# EAGLE design relais_node_01 (EAGLE 9.6.2)

## Sheet 1 of 2
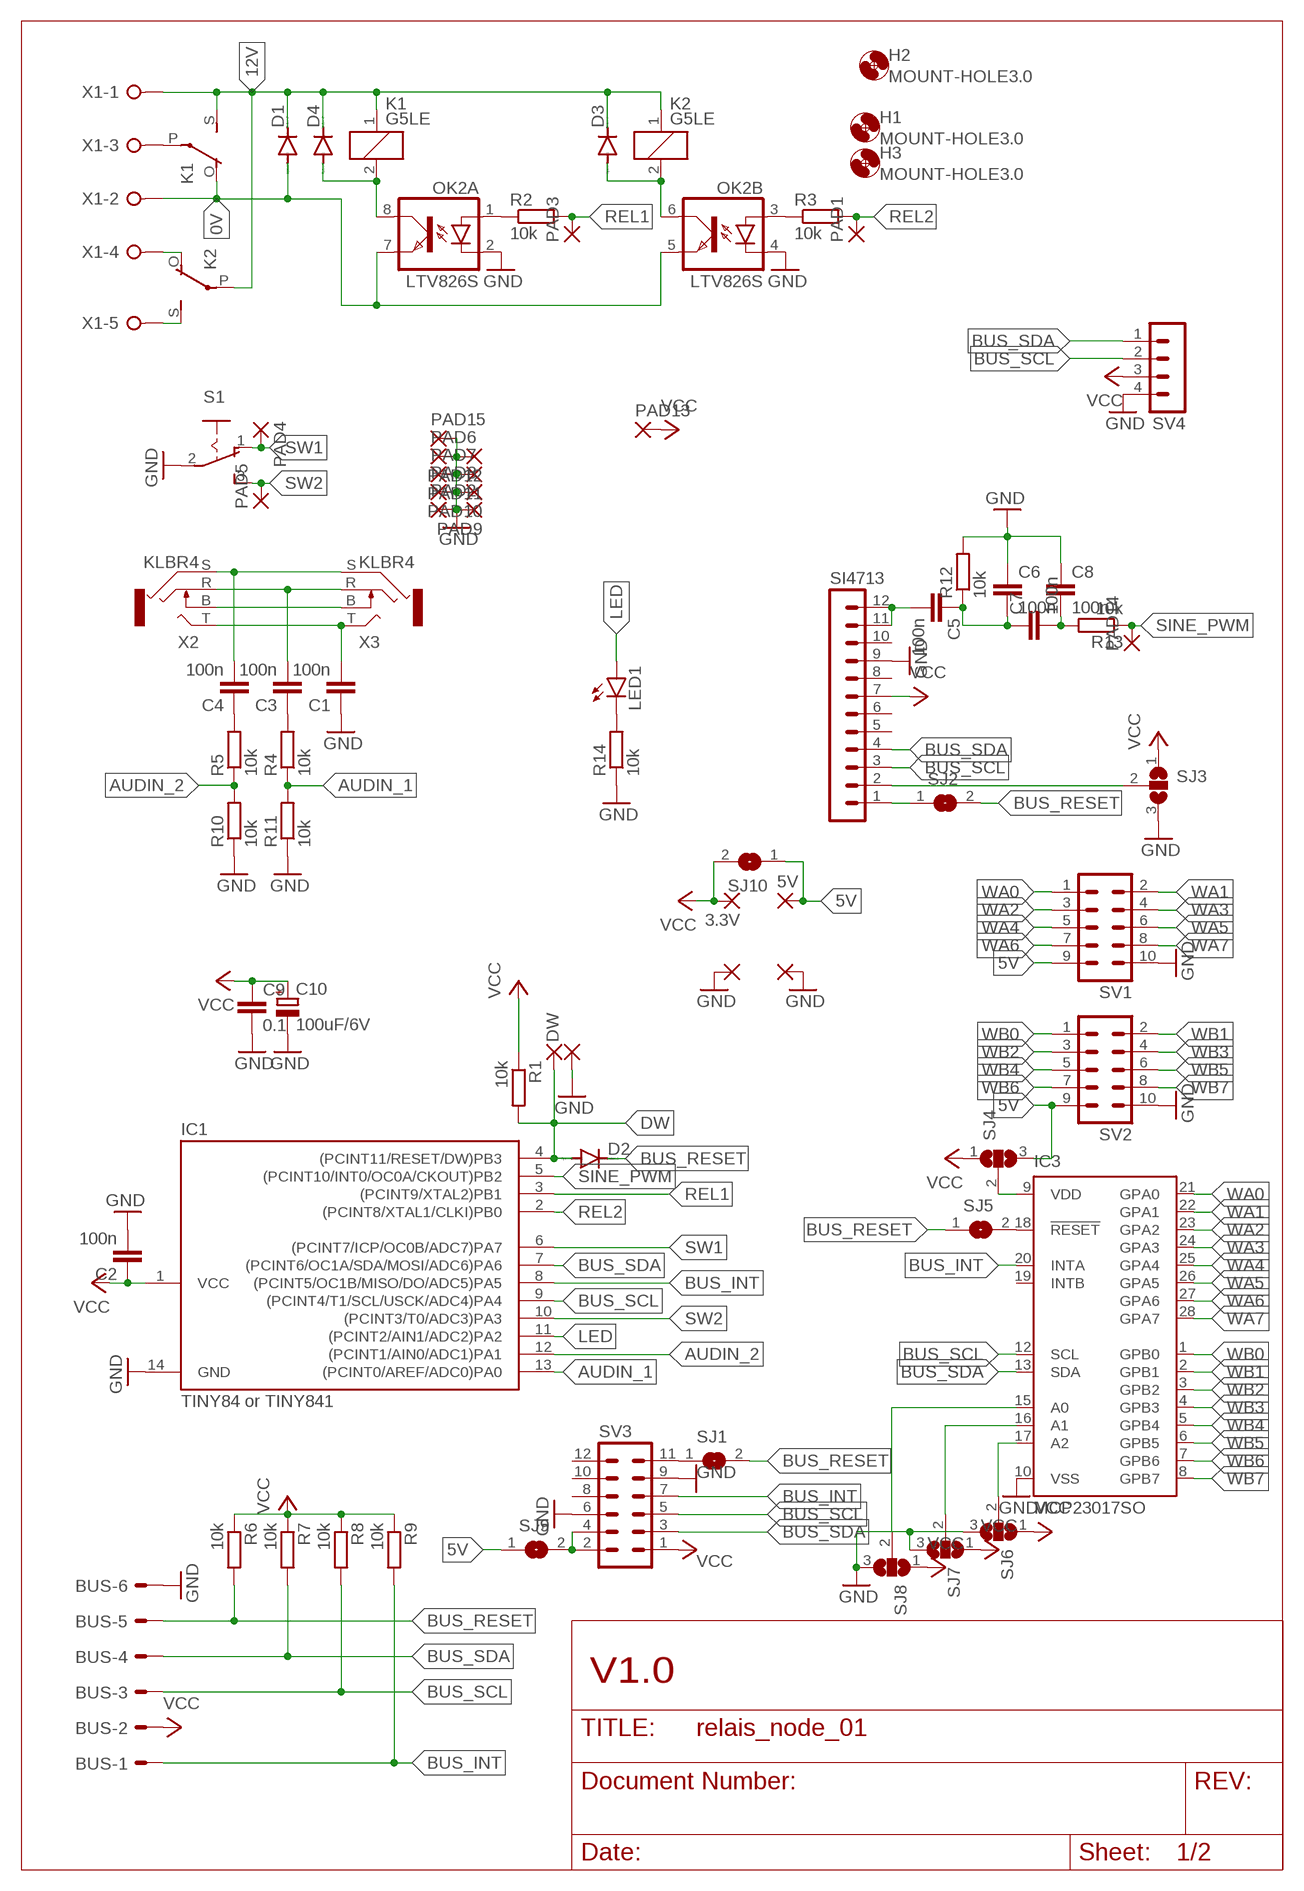
[diagram p0: schematic, sheet 1]

### Parts
3.3V  1,6/0,8  [1,6/0,8]
5V  1,6/0,8  [1,6/0,8]
BUS  ML6LE  [ML6L]
C1  100n  C-EUC0805  [C0805]
C2  100n  C-EUC0805  [C0805]
C3  100n  C-EUC0805  [C0805]
C4  100n  C-EUC0805  [C0805]
C5  100n  C-EUC0805  [C0805]
C6  100n  C-EUC0805  [C0805]
C7  100n  C-EUC0805  [C0805]
C8  100n  C-EUC0805  [C0805]
C9  0.1  C-EUC0805  [C0805]
C10  100uF/6V  CPOL-EUB/3528-21R  [B/3528-21R]
D1  DIODE-MELF-MLL41  [MELF-MLL41]
D2  DIODE-MINIMELF  [MINIMELF]
D3  DIODE-MINIMELF  [MINIMELF]
D4  DIODE-MINIMELF  [MINIMELF]
DW  1,6/0,9  [1,6/0,9]
GND_  1,6/0,9  [1,6/0,9]
H1  MOUNT-HOLE3.0  [3,0]
H2  MOUNT-HOLE3.0  [3,0]
H3  MOUNT-HOLE3.0  [3,0]
IC1  TINY84 or TINY841  TINY24/44/84-SSU  [SOIC14]
IC3  MCP23017SO  [SO28W]
K1  G5LE  [G5LE]
K2  G5LE  [G5LE]
LED1  LED3MM  [LED3MM]
OK2  LTV826S  [DIL8-SMD]
PAD1  1,6/0,8  [1,6/0,8]
PAD2  1,6/0,8  [1,6/0,8]
PAD3  1,6/0,8  [1,6/0,8]
PAD4  1,6/0,8  [1,6/0,8]
PAD5  1,6/0,8  [1,6/0,8]
PAD6  1,6/0,8  [1,6/0,8]
PAD7  1,6/0,8  [1,6/0,8]
PAD8  1,6/0,8  [1,6/0,8]
PAD9  1,6/0,8  [1,6/0,8]
PAD10  1,6/0,8  [1,6/0,8]
PAD11  1,6/0,8  [1,6/0,8]
PAD12  1,6/0,8  [1,6/0,8]
PAD13  1,6/0,8  [1,6/0,8]
PAD14  1,6/0,8  [1,6/0,8]
PAD15  1,6/0,8  [1,6/0,8]
PAD16  1,6/0,8  [1,6/0,8]
PAD17  1,6/0,8  [1,6/0,8]
R1  10k  R-EU_M0805  [M0805]
R2  10k  R-EU_M0805  [M0805]
R3  10k  R-EU_M0805  [M0805]
R4  10k  R-EU_M0805  [M0805]
R5  10k  R-EU_M0805  [M0805]
R6  10k  R-EU_M0805  [M0805]
R7  10k  R-EU_M0805  [M0805]
R8  10k  R-EU_M0805  [M0805]
R9  10k  R-EU_M0805  [M0805]
R10  10k  R-EU_M0805  [M0805]
R11  10k  R-EU_M0805  [M0805]
R12  10k  R-EU_M0805  [M0805]
R13  10k  R-EU_M0805  [M0805]
R14  10k  R-EU_M0805  [M0805]
S1  255SB  [255SB]
SI4713  MA12-1  [MA12-1]
SJ1  SJ  [SJ]
SJ2  SJ  [SJ]
SJ3  SJ2W  [SJ_2]
SJ4  SJ2W  [SJ_2]
SJ5  SJ  [SJ]
SJ6  SJ2W  [SJ_2]
SJ7  SJ2W  [SJ_2]
SJ8  SJ2W  [SJ_2]
SJ9  SJ  [SJ]
SJ10  SJ  [SJ]
SV1  ML10  [ML10]
SV2  ML10  [ML10]
SV3  MA06-2  [MA06-2]
SV4  MA04-1  [MA04-1]
X1  W237-05P  [W237-5P]
X2  KLBR4  [KLBR4]
X3  KLBR4  [KLBR4]

### Nets
0V [gnd]: D1.A K1.O(2:O) OK2.5(B:EMIT) OK2.7(A:EMIT) X1.2
5V [power]: 5V.1(P) SJ4.3 SJ9.1 SJ10.1 SV1.9 SV2.9
5VRPI [power]: SJ9.2 SV3.2 SV3.4
12V [power]: D1.C D3.C D4.C K1.1 K1.S(2:S) K2.1 K2.P(2:P) X1.1
AUDIN_1: IC1.13((PCINT0/AREF/ADC0)PA0) R4.1 R11.2
AUDIN_2: IC1.12((PCINT1/AIN0/ADC1)PA1) R5.1 R10.2
B [power]: X2.B X3.B
BUS_INT: BUS.1 IC1.8((PCINT5/OC1B/MISO/DO/ADC5)PA5) IC3.20(INTA) R9.2 SV3.7
BUS_RESET: BUS.5 D2.C R6.2 SJ1.2 SJ2.2 SJ5.1
BUS_SCL: BUS.3 IC1.9((PCINT4/T1/SCL/USCK/ADC4)PA4) IC3.12(SCL) R8.2 SI4713.3 SV3.5 SV4.2
BUS_SDA: BUS.4 IC1.7((PCINT6/OC1A/SDA/MOSI/ADC6)PA6) IC3.13(SDA) R7.2 SI4713.4 SV3.3 SV4.1
DW: D2.A DW.1(P) IC1.4((PCINT11/RESET/DW)PB3) R1.2
GND [gnd]: BUS.6 C1.1 C2.2 C6.1 C8.1 C9.2 C10.- GND_.1(P) IC1.14(GND) IC3.10(VSS) OK2.2(A:C) OK2.4(B:C) PAD2.1(P) PAD6.1(P) PAD7.1(P) PAD8.1(P) PAD9.1(P) PAD10.1(P) PAD11.1(P) PAD12.1(P) PAD15.1(P) PAD16.1(P) PAD17.1(P) R10.1 R11.1 R12.2 R14.1 S1.2(P) SI4713.9 SJ3.3 SJ6.3 SJ7.3 SJ8.3 SV1.10 SV2.10 SV3.6 SV3.9 SV4.4
LED: IC1.11((PCINT2/AIN1/ADC2)PA2) LED1.A
N$1: SJ1.1 SV3.11
N$2: K1.P(2:P) X1.3
N$3: D4.A K1.2 OK2.8(A:COL)
N$4: D3.A K2.2 OK2.6(B:COL)
N$5: K2.S(2:S) X1.5
N$6: K2.O(2:O) X1.4
N$7: OK2.1(A:A) R2.1
N$8: OK2.3(B:A) R3.1
N$13: C3.1 R4.2
N$14: C4.1 R5.2
N$15: SI4713.1 SJ2.1
N$16: SI4713.2 SJ3.2
N$17: LED1.K(C) R14.2
N$18: IC3.9(VDD) SJ4.2
N$19: IC3.18(!RESET) SJ5.2
N$21: C5.2 SI4713.11 SI4713.12
N$22: C5.1 C6.2 C7.1 R12.1
N$23: C7.2 C8.2 R13.2
N$27: IC3.17(A2) SJ6.2
N$28: IC3.16(A1) SJ7.2
N$29: IC3.15(A0) SJ8.2
R [power]: C3.2 X2.R X3.R
REL1: IC1.3((PCINT9/XTAL2)PB1) PAD3.1(P) R2.2
REL2: IC1.2((PCINT8/XTAL1/CLKI)PB0) PAD1.1(P) R3.2
S [power]: C4.2 X2.S X3.S
SINE_PWM: IC1.5((PCINT10/INT0/OC0A/CKOUT)PB2) PAD14.1(P) R13.1
SW1: IC1.6((PCINT7/ICP/OC0B/ADC7)PA7) PAD4.1(P) S1.1(O)
SW2: IC1.10((PCINT3/T0/ADC3)PA3) PAD5.1(P) S1.3(S)
T [power]: C1.2 X2.T X3.T
VCC [power]: 3.3V.1(P) BUS.2 C2.1 C9.1 C10.+ IC1.1(VCC) PAD13.1(P) R1.1 R6.1 R7.1 R8.1 R9.1 SI4713.7 SJ3.1 SJ4.1 SJ6.1 SJ7.1 SJ8.1 SJ10.2 SV3.1 SV4.3
WA0: IC3.21(GPA0) SV1.1
WA1: IC3.22(GPA1) SV1.2
WA2: IC3.23(GPA2) SV1.3
WA3: IC3.24(GPA3) SV1.4
WA4: IC3.25(GPA4) SV1.5
WA5: IC3.26(GPA5) SV1.6
WA6: IC3.27(GPA6) SV1.7
WA7: IC3.28(GPA7) SV1.8
WB0: IC3.1(GPB0) SV2.1
WB1: IC3.2(GPB1) SV2.2
WB2: IC3.3(GPB2) SV2.3
WB3: IC3.4(GPB3) SV2.4
WB4: IC3.5(GPB4) SV2.5
WB5: IC3.6(GPB5) SV2.6
WB6: IC3.7(GPB6) SV2.7
WB7: IC3.8(GPB7) SV2.8
Unconnected: IC3.19(INTB) SI4713.5 SI4713.6 SI4713.8 SI4713.10 SV3.8 SV3.10 SV3.12

### Notes on the sheet
- V1.0

## Sheet 2 of 2

## Library data of the parts
3.3V 5V PAD1-PAD17 = wirepad:1,6/0,8: THROUGH-HOLE PAD
BUS = con-harting-ml:ML6?E: HARTING; OC_FARNELL: unknown; OC_NEWARK: unknown
C1-C9 = rcl:C-EU: CAPACITOR, European symbol
C10 = rcl:CPOL-EU: POLARIZED CAPACITOR, European symbol
D1-D4 = diode:DIODE-: DIODE
DW GND_ = wirepad:1,6/0,9: THROUGH-HOLE PAD
H1-H3 = holes:MOUNT-HOLE: MOUNTING HOLE with drill center marker
IC1 = avr-7:TINY24/44/84
IC3 = microchip-6:MCP23017: http://ww1.microchip.com/downloads/en/DeviceDoc/21952a.pdf Source: http://ww1.microchip.com/downloads/en/DeviceDoc/21952a.pdf
K1 K2 = relay:G5LE: RELAY 1 x switch, 10 A/120 V AC, 8 A/30 V DC, Omron; OC_FARNELL: unknown; OC_NEWARK: unknown
LED1 = led:LED: LED OSRAM: - CHIPLED LG R971, LG N971, LY N971, LG Q971, LY Q971, LO R971, LY R971 LH N974, LH R974 LS Q976, LO Q976, LY Q976 LO Q996 - Hyper CHIPLED LW Q18S LB Q993, LB Q99A, LB R99A - SideLED LS A670, LO A670, LY A670, LG A670, LP A670 LB A673, LV A673, LT A673, LW A673 LH A674 LY A675 LS A676, LA A676, LO A676, LY A676, LW A676 LS A679, LY A679, LG A679 - Hyper Micro SIDELED® LS Y876, LA Y876, LO Y876, LY Y876 LT Y87S - SmartLED LW L88C, LW L88S LB L89C, LB L89S, LG L890 LS L89K, LO L89K, LY L89K LS L896, LA L896, LO L896, LY L896 - TOPLED LS T670, LO T670, LY T670, LG T670, LP T670 LSG T670, LSP T670, LSY T670, LOP T670, LYG T670 LG T671, LOG T671, LSG T671 LB T673, LV T673, LT T673, LW T673 LH T674 LS T676, LA T676, LO T676, LY T676, LB T676, LH T676, LSB T676, LW T676 LB T67C, LV T67C, LT T67C, LS T67K, LO T67K, LY T67K, LW E67C LS E67B, LA E67B, LO E67B, LY E67B, LB E67C, LV E67C, LT E67C LW T67C LS T679, LY T679, LG T679 LS T770, LO T770, LY T770, LG T770, LP T770 LB T773, LV T773, LT T773, LW T773 LH T774 LS E675, LA E675, LY E675, LS T675 LS T776, LA T776, LO T776, LY T776, LB T776 LHGB T686 LT T68C, LB T68C - Hyper Mini TOPLED® LB M676 - Mini TOPLED Santana® LG M470 LS M47K, LO M47K, LY M47K Source: http://www.osram.convergy.de LUXEON: - LUMILED® LXK2-PW12-R00, LXK2-PW12-S00, LXK2-PW14-U00, LXK2-PW14-V00 LXK2-PM12-R00, LXK2-PM12-S00, LXK2-PM14-U00 LXK2-PE12-Q00, LXK2-PE12-R00, LXK2-PE12-S00, LXK2-PE14-T00, LXK2-PE14-U00 LXK2-PB12-K00, LXK2-PB12-L00, LXK2-PB12-M00, LXK2-PB14-N00, LXK2-PB14-P00, LXK2-PB14-Q00 LXK2-PR12-L00, LXK2-PR12-M00, LXK2-PR14-Q00, LXK2-PR14-R00 LXK2-PD12-Q00, LXK2-PD12-R00, LXK2-PD12-S00 LXK2-PH12-R00, LXK2-PH12-S00 LXK2-PL12-P00, LXK2-PL12-Q00, LXK2-PL12-R00 Source: www.luxeon.com KINGBRIGHT: KA-3528ASYC Source: www.kingbright.com
OK2 = optocoupler:LTV826: OPTO COUPLER Source: LITEON, LTV816.pdf; OC_FARNELL: unknown; OC_NEWARK: unknown
R1-R14 = rcl:R-EU_: RESISTOR, European symbol; SPICEPREFIX: R
S1 = switch:255SB: SLIDING SWITCH Distributor Buerklin, 11G810
SI4713 = con-lstb:MA12-1: PIN HEADER; OC_FARNELL: unknown; OC_NEWARK: unknown
SJ1 SJ2 SJ5 SJ9 SJ10 = jumper:SJ: SMD solder JUMPER
SJ3 SJ4 SJ6-SJ8 = jumper:SJ2W: SMD solder JUMPER
SV1 SV2 = con-harting-ml:ML10: HARTING; OC_FARNELL: unknown; OC_NEWARK: unknown
SV3 = con-lstb:MA06-2: PIN HEADER; OC_FARNELL: unknown; OC_NEWARK: unknown
SV4 = con-lstb:MA04-1: PIN HEADER; OC_FARNELL: unknown; OC_NEWARK: unknown
X1 = con-wago-508:W237-05P: WAGO SREW CLAMP; OC_FARNELL: unknown; OC_NEWARK: unknown
X2 X3 = con-lumberg:KLBR4: Jack connectors according to JISC 6560, 3.5 mm Klinkeneinbaukupplung nach JISC 6560, 3,5 mm, 3-polig/ stereo, abgewinkelte Ausführung, mit Öffner, für Leiterplatten Source: Data sheet <http://www.lumberg.com/Produkte/PDFs/KLBR4.pdf>; MPN: KLBR 4; OC_FARNELL: 1217016; OC_NEWARK: 97K2709

## Net classes
1 gnd: width 0.381 mm, drill 0.381 mm
2 power: width 0.381 mm, drill 0.381 mm

## Board
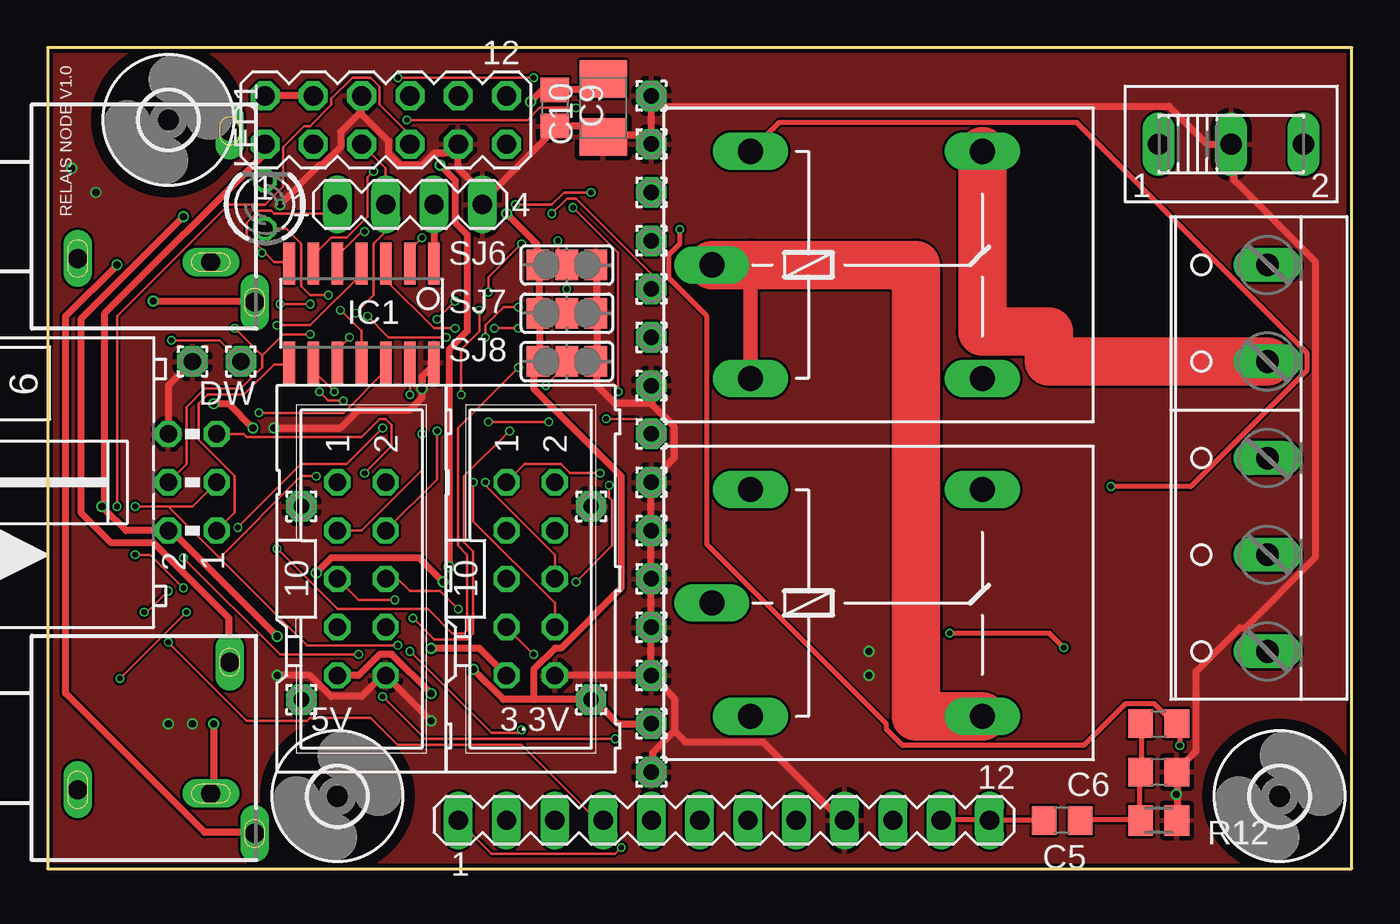
[diagram p1: board, top side]
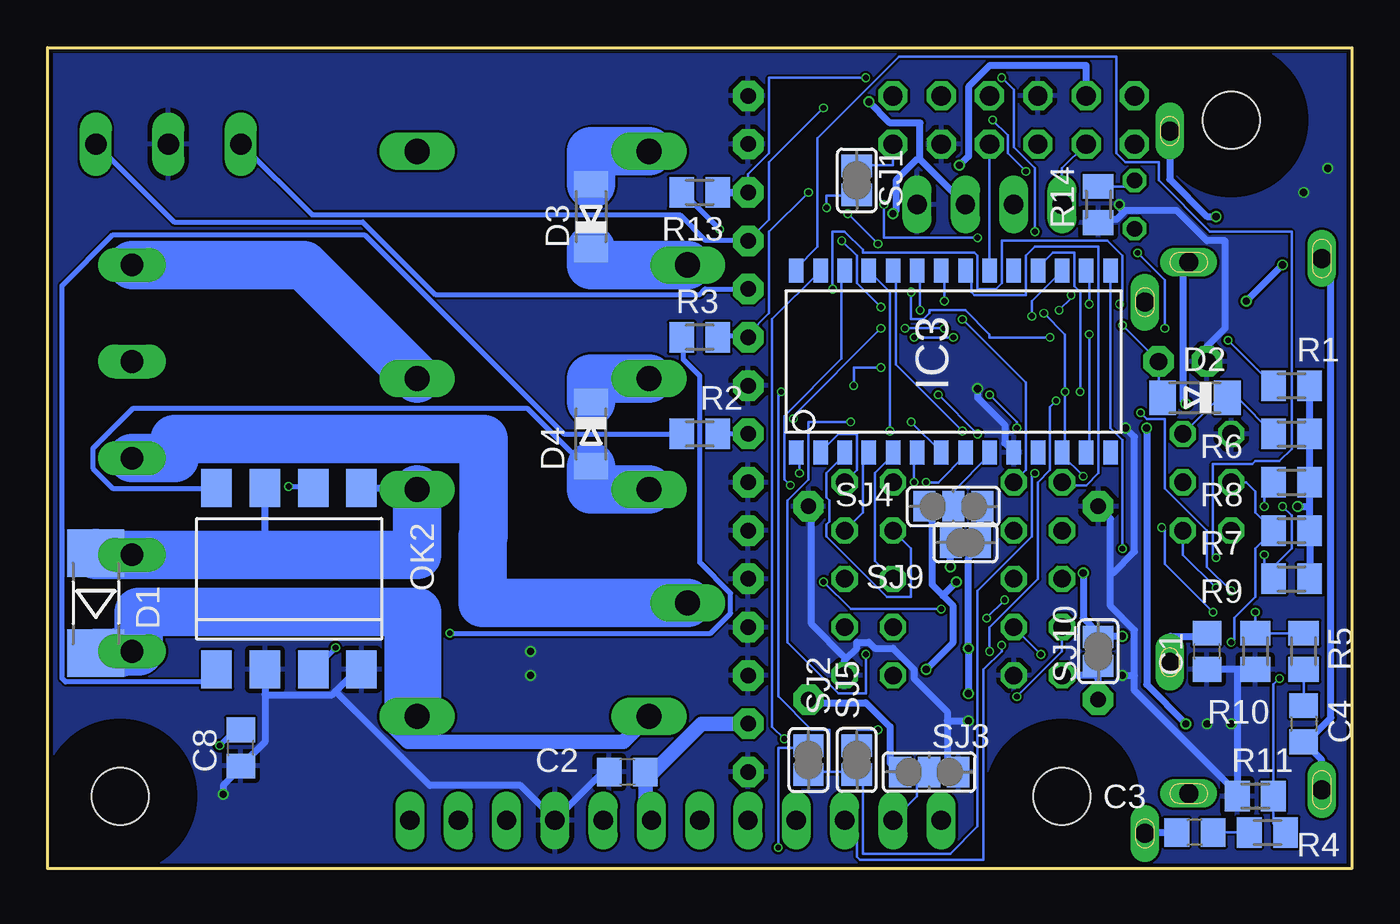
[diagram p2: board, bottom side, seen from below]

Size 68.58 x 43.18 mm. Coordinates in mm from the lower left corner, seen from the top.
Outline: 0,0 68.58,0 68.58,43.18 0,43.18 0,0
Copper layers (1*16): Top 0.035559375mm / dielectric 1.6mm / Bottom 0.035559375mm
Design rules "jlcpcb2layer": minimum track width 5mil, minimum drill 12mil, track to track 5mil, track to pad 5mil, pad to pad 5mil, via to via 5mil, smd to smd 5mil, copper to edge 8mil, drill to drill 6mil, minimum pad ring 5mil, minimum via ring 3mil, stop-mask expansion 2.5mil, vias tented up to drill 0mil, thermal gap 10mil

### Footprints (pad centres in the part's own frame; a part is rotated, then mirrored left to right if it is on the bottom)
1,6/0,8 = drill 0.813 pad 1.6 octagon: 1 0,0
ML6L = drill 0.914 octagon: 1 -2.54,-1.27; 2 -2.54,1.27; 3 0,-1.27; 4 0,1.27; 5 2.54,-1.27; 6 2.54,1.27
C0805 = smd 1.3 x 1.5: 1 -0.95,0; 2 0.95,0
B/3528-21R = smd 1.95 x 2.5: + 1.525,0; - -1.525,0
MELF-MLL41 = smd 2.5 x 3: A 2.625,0; C -2.625,0
MINIMELF = smd 1.4 x 1.8: A 1.7,0; C -1.7,0
1,6/0,9 = drill 0.914 pad 1.6 octagon: 1 0,0
3,0 = hole 3: 0,0
SOIC14 = smd 0.61 x 2.21: 1 -3.81,-2.603; 2 -2.54,-2.603; 3 -1.27,-2.603; 4 0,-2.603; 5 1.27,-2.603; 6 2.54,-2.603; 7 3.81,-2.603; 8 3.81,2.603; 9 2.54,2.603; 10 1.27,2.603; 11 0,2.603; 12 -1.27,2.603; 13 -2.54,2.603; 14 -3.81,2.603
SO28W = smd 0.762 x 1.27: 1 -7.62,-4.78; 2 -6.35,-4.78; 3 -5.08,-4.78; 4 -3.81,-4.78; 5 -2.54,-4.78; 6 -1.27,-4.78; 7 0,-4.78; 8 1.27,-4.78; 9 2.54,-4.78; 10 3.81,-4.78; 11 5.08,-4.78; 12 6.35,-4.78; 13 7.62,-4.78; 14 8.89,-4.78; 15 8.89,4.78; 16 7.62,4.78; 17 6.35,4.78; 18 5.08,4.78; 19 3.81,4.78; 20 2.54,4.78; 21 1.27,4.78; 22 0,4.78; 23 -1.27,4.78; 24 -2.54,4.78; 25 -3.81,4.78; 26 -5.08,4.78; 27 -6.35,4.78; 28 -7.62,4.78
G5LE = drill 1.321 long: 1 -7.493,-5.969; 2 -7.493,5.969; O 4.699,5.969; P -9.525,0; S 4.699,-5.969
LED3MM = drill 0.813 octagon: A -1.27,0; K 1.27,0
DIL8-SMD = smd 1.6 x 2: 1 -3.81,-4.77; 2 -1.27,-4.77; 3 1.27,-4.77; 4 3.81,-4.77; 5 3.81,4.77; 6 1.27,4.77; 7 -1.27,4.77; 8 -3.81,4.77
M0805 = smd 1.3 x 1.6: 1 -0.95,0; 2 0.95,0
255SB = drill 1.118 long: 1 -3.81,0; 2 0,0; 3 3.81,0
MA12-1 = drill 1.016 long: 1 -13.97,0; 2 -11.43,0; 3 -8.89,0; 4 -6.35,0; 5 -3.81,0; 6 -1.27,0; 7 1.27,0; 8 3.81,0; 9 6.35,0; 10 8.89,0; 11 11.43,0; 12 13.97,0
SJ = smd 1.168 x 1.6: 1 -0.762,0; 2 0.762,0
SJ_2 = smd 1.168 x 1.6: 1 -1.524,0; 2 0,0; 3 1.524,0
ML10 = drill 0.914 octagon: 1 -5.08,-1.27; 2 -5.08,1.27; 3 -2.54,-1.27; 4 -2.54,1.27; 5 0,-1.27; 6 0,1.27; 7 2.54,-1.27; 8 2.54,1.27; 9 5.08,-1.27; 10 5.08,1.27
MA06-2 = drill 1.016 octagon: 1 -6.35,-1.27; 2 -6.35,1.27; 3 -3.81,-1.27; 4 -3.81,1.27; 5 -1.27,-1.27; 6 -1.27,1.27; 7 1.27,-1.27; 8 1.27,1.27; 9 3.81,-1.27; 10 3.81,1.27; 11 6.35,-1.27; 12 6.35,1.27
MA04-1 = drill 1.016 long: 1 -3.81,0; 2 -1.27,0; 3 1.27,0; 4 3.81,0
W237-5P = drill 1.194 long: 1 -10.16,-0.635; 2 -5.08,-0.635; 3 0,-0.635; 4 5.08,-0.635; 5 10.16,-0.635
KLBR4 = drill 1 pad 1.3 long: B -2.4,-3.5; S -2.2,3.5 | drill 1 pad 1.2 long: R -4.5,-5.8; T 4.5,-4.5

### Placement (x,y rotation side)
3.3V  28.57,8.89 90 top
5V  13.34,8.89 90 top
BUS  7.62,20.32 90 top
C1  7.62,11.43 90 bottom
C2  38.1,5.08 180 bottom
C3  8.26,1.91 180 bottom
C4  2.54,7.62 270 bottom
C5  53.34,2.54 180 top
C6  58.42,5.08 180 top
C7  58.42,7.62 0 top
C8  58.42,6.35 90 bottom
C9  26.67,40.01 270 top
C10  29.21,40.01 90 top
D1  66.04,13.97 90 bottom
D2  8.26,24.77 180 bottom
D3  40.01,34.29 90 bottom
D4  40.01,22.86 270 bottom
DW  10.16,26.67 90 top
GND_  7.62,26.67 90 top
H1  64.77,3.81 0 top
H2  6.35,39.37 0 top
H3  15.24,3.81 0 top
IC1  16.51,29.21 180 top
IC3  21.59,26.67 0 bottom
K1  44.45,13.97 0 top
K2  44.45,31.75 0 top
LED1  11.43,34.92 90 top
OK2  55.88,15.24 0 bottom
PAD1  31.75,27.94 0 top
PAD2  31.75,5.08 0 top
PAD3  31.75,22.86 0 top
PAD4  31.75,33.02 0 top
PAD5  31.75,30.48 0 top
PAD6  31.75,38.1 0 top
PAD7  31.75,25.4 0 top
PAD8  31.75,20.32 0 top
PAD9  31.75,17.78 0 top
PAD10  31.75,15.24 0 top
PAD11  31.75,12.7 0 top
PAD12  31.75,10.16 0 top
PAD13  31.75,7.62 0 top
PAD14  31.75,35.56 0 top
PAD15  31.75,40.64 0 top
PAD16  13.34,19.05 90 top
PAD17  28.57,19.05 90 top
R1  3.17,25.4 180 bottom
R2  34.29,22.86 0 bottom
R3  34.29,27.94 0 bottom
R4  4.45,1.91 180 bottom
R5  2.54,11.43 270 bottom
R6  3.17,22.86 180 bottom
R7  3.17,17.78 180 bottom
R8  3.17,20.32 180 bottom
R9  3.17,15.24 180 bottom
R10  5.08,11.43 90 bottom
R11  5.08,3.81 0 bottom
R12  58.42,2.54 0 top
R13  34.29,35.56 180 bottom
R14  13.34,34.92 90 bottom
S1  62.23,38.1 0 top
SI4713  35.56,2.54 0 top
SJ1  26.04,36.2 270 bottom
SJ2  28.57,5.71 270 bottom
SJ3  22.23,5.08 0 bottom
SJ4  20.95,19.05 0 bottom
SJ5  26.04,5.71 90 bottom
SJ6  27.3,31.75 0 top
SJ7  27.3,29.21 0 top
SJ8  27.3,26.67 0 top
SJ9  20.32,17.14 180 bottom
SJ10  13.34,11.43 90 bottom
SV1  16.51,15.24 270 top
SV2  25.4,15.24 270 top
SV3  17.78,39.37 0 top
SV4  19.05,34.92 0 top
X1  63.5,21.59 90 top
X2  5.08,34.29 90 top
X3  5.08,6.35 90 top

### Tracks (layer width: path | path; a pad name or v marks a point on that pad's centre or on a via)
0V
  Bottom 0.381: OK2.5 52.01,20 50.39,20 K1.O | 57.15,16.51 OK2.7
  Bottom 2.54: K1.O 49.15,16.51 57.15,16.51 X1.2 66.04,16.51 D1.A
5V  (via drill 0.38)
  Top 0.381: v20.16,11.59 22.7,11.59 SV2.9 | SV1.9 16.35,10.16 17.46,11.27 18.1,11.27 v20.16,9.21
  Bottom 0.381: 5V.1 SJ10.1 13.49,10.16 SV1.9 | SJ4.3 19.53,19.05 19.53,17.14 SJ9.1 19.53,16.99 20.16,16.35 v20.16,11.59 v20.16,9.21
5VRPI  (via drill 0.38)
  Top 0.381: v21.11,15.88 21.11,27.3 22.07,28.26 22.07,33.34 21.43,33.97 21.43,36.2 v20.64,36.99 | SV3.4 SV3.2
  Bottom 0.381: v21.11,15.88 21.11,17.14 SJ9.2 | v20.64,36.99 20.16,37.47 20.16,41.12 19.05,42.23 13.97,42.23 SV3.4
12V
  Top 0.762: 36.96,31.75 K2.1
  Top 2.54: K2.P 36.96,31.75 45.64,31.75 45.64,8 K1.S
  Bottom 0.762: D1.C 65.34,11.34 X1.1 | 50.48,13.5 50.48,7.53 49.62,6.67 38.29,6.67 K1.1
  Bottom 2.54: X1.1 63.79,11.43 63.79,13.5 50.48,13.5 49.15,13.5 K1.S | 64.77,11.43 64.77,11.35 D1.C | D3.C 40.01,31.75 K2.P | K2.1 40.01,25.78 D4.C
AUDIN_1  (via drill 0.3)
  Top 0.127: v19.05,24.92 IC1.13 | v17.62,23.18 15.72,21.27 13.34,21.27 v10,17.94 | v3.81,10 v7.3,13.49
  Bottom 0.127: R11.2 4.13,2.38 3.65,1.91 R4.1 | v19.05,24.92 17.62,23.5 v17.62,23.18 | v10,17.94 9.84,17.78 9.84,16.03 v7.3,13.49 | v3.81,10 4.13,9.68 R11.2 | R11.2
AUDIN_2  (via drill 0.3)
  Top 0.127: IC1.12 17.78,26.19 15.56,23.97 v11.11,23.97 | v6.35,14.61 5.24,13.49 v5.08,13.49
  Bottom 0.127: R10.2 R5.1 | v11.11,23.97 10.79,23.65 9.84,23.65 9.84,20 7.62,17.78 7.62,15.88 v6.35,14.61 | R10.2 v5.08,13.49 | R10.2
B  (via drill 0.38)
  Top 0.381: v8.73,7.62 8.73,3.97 X3.B | v10.79,23.18 9.53,24.45 v8.73,24.45
  Bottom 0.381: v8.73,7.62 10.79,9.68 v10.79,23.18 | v8.73,24.45 8.89,24.61 8.89,31.59 8.73,31.75 X2.B
BUS_INT  (via drill 0.3)
  Top 0.127: v4.6,16.51 5.4,16.51 v7.14,14.76 | BUS.1 9.84,18.73 9.84,20.64 7.94,22.54 7.94,24.45 8.41,24.92 10.32,24.92 11.91,26.51 12.7,26.51 IC1.8 | SV3.7 19.05,38.58 17.46,40.16 17.46,41.12 16.99,41.59 16.03,41.59 14.92,40.48 14.92,40.16 13.81,39.05 13.49,39.05 12.38,37.94 12.38,35.88 11.43,34.92 9.53,34.92 3.65,29.05 v3.65,19.05
  Bottom 0.127: SV3.7 IC3.20 | 4.45,15.56 4.6,15.72 v4.6,16.51 | 4.45,15.56 R9.2 4.45,15.56 | v7.14,14.76 8.89,16.51 BUS.1 | v3.65,19.05 3.17,18.57 3.17,16.83 4.45,15.56
BUS_RESET  (via drill 0.3)
  Top 0.127: v27.62,34.77 30,32.38 v30,25.08 | BUS.5 10.32,22.86 10.48,22.7 16.51,22.7 17.46,23.65 17.78,23.65 18.1,23.34 18.1,22.23 v16.67,20.8
  Bottom 0.127: R6.2 6.03,24.77 D2.C 6.99,24.77 BUS.5 | 27.46,5.08 28.57,5.08 SJ2.2 | 27.46,5.08 26.04,5.08 SJ5.1 26.04,4.92 25.72,4.6 25.72,0.79 21.11,0.79 19.68,2.22 19.68,14.61 16.83,17.46 16.83,20.64 v16.67,20.8 | v27.62,34.77 27.62,35.4 26.04,35.4 SJ1.2 | v30,25.08 30.16,24.92 30.16,9.05 28.42,7.3 27.46,7.3 27.46,5.08
BUS_SCL  (via drill 0.3)
  Top 0.127: SV3.5 17.78,36.83 SV4.2 17.78,33.5 17.14,32.86 17.14,30.16 v16.19,29.21 | v15.08,25.08 13.97,26.19 IC1.9 | 6.35,19.05 7.62,19.05 BUS.3 | 6.35,19.05 v4.6,19.05 | v18.41,11.75 13.65,11.75 9.05,16.35 | 6.35,19.05 9.05,16.35 | v14.13,20.64 13.34,20.64 9.05,16.35
  Bottom 0.127: v4.6,19.05 4.6,19.84 R8.2 | SI4713.3 26.04,1.91 26.04,0.64 25.88,0.48 19.37,0.48 19.37,10.48 18.41,11.43 v18.41,11.75 | v14.13,20.64 15.24,21.75 IC3.12 15.24,21.91 15.08,22.07 v15.08,25.08 15.08,28.1 v16.19,29.21
BUS_SDA  (via drill 0.3)
  Top 0.127: 11.27,32.54 10.48,33.34 10.48,33.97 11.11,34.61 11.75,34.61 11.91,34.45 14.76,34.45 SV4.1 | 11.27,32.54 11.91,31.91 12.7,31.91 IC1.7 | v13.81,28.1 12.38,28.1 11.27,26.99 | 11.27,26.99 11.27,26.35 10.16,25.24 8.26,25.24 7.3,24.29 7.3,21.27 BUS.4 | SI4713.4 28.89,2.54 24.92,6.51 18.41,6.51 16.99,7.94 13.81,7.94 13.65,7.78 10.48,7.78 v6.35,11.91 | v11.27,32.38 11.27,32.54 | 11.27,26.99 v9.84,28.42
  Bottom 0.127: SV3.3 15.24,36.83 SV4.1 | v13.81,28.1 13.81,22.07 13.97,21.91 IC3.13 | R7.2 5.08,18.73 5.08,19.84 5.56,20.32 BUS.4 | v6.35,11.91 6.19,12.06 6.19,13.18 5.08,14.29 5.08,16.83 R7.2 | R7.2 | v11.27,32.38 9.84,30.96 v9.84,28.42
DW  (via drill 0.3)
  Top 0.127: v6.51,27.78 9.05,27.78 DW.1 | IC1.4 16.51,31.27 13.81,28.57 v12.06,28.57
  Bottom 0.127: v6.51,27.78 R1.2 | D2.A 10,24.77 10.16,24.92 DW.1 v12.06,28.57
GND  (via drill 0.38)
  Top 0.381: 59.44,3.9 59.44,2.57 R12.2 | 59.44,3.9 59.44,5.05 C6.1 59.44,5.24 60.39,6.19 60.39,10.38 62.67,12.67 62.96,12.67 66.67,16.38 66.67,31.91 62.39,36.2 62.39,38.01 S1.2 60.96,38.1 58.96,40.1 31.81,40.1 PAD15.1 31.72,40.58 31.72,38.1 PAD6.1 31.59,38.58 29.37,38.58 C10.- 29.21,38.58 28.73,39.05 C9.2 26.67,38.89 23.34,35.56 23.02,35.56 SV4.4 22.86,35.56 21.59,36.83 SV3.9 21.43,37.62 20.32,37.62 19.68,36.99 18.57,36.99 17.94,37.62 17.94,38.26 16.51,39.69 | v59.34,3.9 59.44,3.9 | 32.96,7.24 31.81,6.1 31.81,5.14 PAD2.1 | 32.96,7.24 32.96,8.95 PAD12.1 | PAD12.1 31.72,10.29 31.72,12.67 PAD11.1 31.72,12.86 31.72,15.24 PAD10.1 31.72,15.34 31.72,17.72 PAD9.1 31.72,17.91 31.72,20.29 PAD8.1 31.81,20.48 32.96,21.62 32.96,23.24 31.81,24.38 | 31.81,24.38 31.81,25.34 PAD7.1 | 32.96,7.24 33.53,6.67 37.62,6.67 41.72,2.57 41.91,2.57 SI4713.9 | IC1.14 20.32,26.51 19.68,25.88 v19.68,25.24 19.68,24.77 19.05,24.13 16.35,24.13 15.4,23.18 v11.91,23.18 | v20.16,7.78 SV1.10 17.62,10.16 16.51,9.05 14.92,9.05 13.81,10.16 v12.06,10.16 | BUS.6 6.35,25.4 GND_.1 | 16.51,39.69 SV3.6 | SJ6.3 28.89,31.75 28.89,29.37 SJ7.3 28.89,29.21 28.89,26.67 SJ8.3 28.89,26.51 28.89,25.4 29.84,24.45 31.75,24.45 31.81,24.38 | v12.22,34.92 14.29,36.99 14.45,36.99 15.4,37.94 15.4,38.73 16.35,39.69 16.51,39.69 | PAD12.1 SV2.10
  Bottom 0.381: OK2.2 57.15,9.14 | 57.15,9.14 57.15,6.67 58.39,5.43 C8.1 58.48,5.24 59.34,4.38 v59.34,3.9 | 53.44,9.34 53.63,9.14 57.15,9.14 | 53.44,9.34 52.39,10.38 52.1,10.38 OK2.4 | C2.2 39.05,5.05 39.43,5.05 41.91,2.57 SI4713.9 42.01,2.67 43.72,4.38 48.48,4.38 53.44,9.34 | v19.68,25.24 19.68,24.77 18.26,23.34 18.26,22.38 17.78,21.91 IC3.10 | 6.03,10.48 R10.1 | 6.03,10.48 C1.1 | 6.03,10.48 R11.1 6.19,4.13 11.43,9.37 11.43,10.16 | PAD16.1 12.7,18.41 12.7,15.56 | 12.7,15.56 12.7,13.81 11.43,12.54 11.43,10.16 | v11.91,23.18 11.43,22.7 11.43,16.67 12.54,15.56 12.7,15.56 | 21.27,7.78 21.27,8.26 23.02,10 23.02,10.48 24.13,11.59 25.08,11.59 25.4,11.91 26.04,11.91 26.04,11.59 26.59,11.03 | 21.27,7.78 21.27,5.56 20.8,5.08 SJ3.3 | 26.59,11.03 26.67,10.95 SV2.10 | 21.27,7.78 v20.16,7.78 | PAD17.1 28.42,18.89 28.42,12.86 26.59,11.03 | 11.99,34.53 11.91,34.61 9.21,34.61 7.62,33.02 6.67,33.02 6.67,28.42 7.62,27.46 GND_.1 | 11.99,34.53 12.38,34.13 13.34,34.13 R14.1 | 11.99,34.53 12.22,34.77 v12.22,34.92 | v12.06,10.16 11.43,10.16
  other vias: 43.18,11.43 43.18,10.16 7.62,7.62 6.35,7.62 1.27,36.83 2.54,35.56
  pour Bottom: 0,0 68.58,0 68.58,43.18 0,43.18
  pour Top: 0,0 68.58,0 68.58,43.18 0,43.18
LED  (via drill 0.3)
  Top 0.127: IC1.11 16.51,28.26 v15.4,29.37 | v14.76,30.16 13.81,30.16 13.34,30.64 13.34,32.86 12.54,33.66 LED1.A
  Bottom 0.127: v15.4,29.37 14.76,30 v14.76,30.16
N$1
  Bottom 0.127: SV3.11 24.13,36.99 26.04,36.99 SJ1.1
N$2
  Bottom 2.54: X1.3 61.89,21.59 61.89,22.61 45.64,22.61 45.64,17.49 45.72,17.49 45.72,13.97 K1.P
N$3
  Bottom 0.254: OK2.8 59.72,20 65.15,20 66.2,21.05 66.2,22.1 64.1,24.19 43.34,24.19 41.05,21.91 D4.A
  Bottom 2.54: K1.2 40.01,19.94 D4.A
N$4  (via drill 0.3)
  Top 0.254: v55.91,20.1 60.1,20.1 66.2,26.19 66.2,27.15 54.1,39.24 38.48,39.24 K2.2
  Bottom 0.254: v55.91,20.1 54.67,20.1 OK2.6
  Bottom 2.54: K2.2 40.01,37.72 D3.A
N$5
  Bottom 2.54: X1.5 55.12,31.75 K2.S
N$6
  Top 2.54: K2.O 49.15,28.23 52.65,28.23 52.65,26.67 X1.4
N$7
  Bottom 0.254: R2.1 41.43,22.86 51.91,33.34 65.15,33.34 67.82,30.67 67.82,10 67.63,9.81 60.29,9.81 59.72,10.38 OK2.1
N$8  (via drill 0.3)
  Top 0.254: v47.43,12.38 52.67,12.38 v53.44,11.62
  Bottom 0.254: v47.43,12.38 33.72,12.38 32.67,13.43 32.67,14.48 34.29,16.1 34.29,25.91 35.15,26.77 35.15,27.91 R3.1 | v53.44,11.62 54.58,10.48 OK2.3
N$13
  Bottom 0.127: R4.2 C3.1
N$14
  Bottom 0.127: R5.2 C4.1
N$15  (via drill 0.3)
  Top 0.127: v30.16,1.11 29.84,0.79 23.34,0.79 SI4713.1
  Bottom 0.127: v30.16,1.11 30.16,6.35 28.57,6.35 SJ2.1
N$16
  Bottom 0.127: SJ3.2 22.86,4.45 22.86,3.81 SI4713.2
N$17
  Bottom 0.127: LED1.K 11.43,35.88 R14.2
N$18
  Bottom 0.127: SJ4.2 20.95,19.84 19.05,21.75 IC3.9
N$19  (via drill 0.3)
  Top 0.127: v14.29,25.08 14.76,24.61 v15.56,24.61 | v19.05,11.43 23.34,7.14 24.77,7.14 v24.92,7.3
  Bottom 0.127: v14.29,25.08 14.29,30.32 14.61,30.64 14.61,32.38 15.72,32.38 16.51,31.59 IC3.18 | v15.56,24.61 15.88,24.29 15.88,20.95 16.51,20.32 16.51,15.24 19.05,12.7 v19.05,11.43 | v24.92,7.3 26.04,7.3 SJ5.2
N$21
  Top 0.254: C5.2 52.39,2.57 49.53,2.57 SI4713.12 49.44,2.57 47.05,2.57 SI4713.11
N$22
  Top 0.254: C5.1 54.29,2.57 57.44,2.57 R12.1 57.44,2.67 57.44,5.05 C6.2 57.53,5.14 57.53,7.62 C7.1
N$23  (via drill 0.3)
  Top 0.254: v59.53,6.48 59.53,7.53 59.44,7.62 C7.2 59.24,7.62 58.2,8.67 56.67,8.67 54.48,6.48 44.96,6.48 44.1,7.33 44.1,7.62 34.67,17.05 34.67,29.05 32.67,31.05 32.67,32.29 33.24,32.86 v33.24,33.62
  Bottom 0.254: v59.53,6.48 58.77,7.24 58.48,7.24 C8.2 | v33.24,33.62 35.15,35.53 R13.2
N$27  (via drill 0.3)
  Top 0.127: v16.83,29.05 17.94,27.94 v20.95,27.94 | v23.02,27.94 23.02,28.57 23.97,29.53 v24.77,29.53 | v26.83,33.02 26.83,32.23 SJ6.2
  Bottom 0.127: v16.83,29.05 16.83,29.84 15.24,31.43 IC3.17 | v23.02,27.94 v20.95,27.94 | v24.77,29.53 26.04,30.8 26.04,32.23 v26.83,33.02
N$28  (via drill 0.3)
  Top 0.127: v12.22,29.69 v13.81,29.69 | SJ7.2 v27.3,30.48
  Bottom 0.127: v13.81,29.69 13.81,31.27 13.97,31.43 IC3.16 | v12.22,29.69 12.06,29.84 12.06,32.23 12.86,33.02 18.41,33.02 18.41,30.8 18.73,30.48 19.68,30.48 19.68,32.23 19.84,32.38 25.72,32.38 25.72,32.54 26.67,33.5 27.3,33.5 v27.3,30.48
N$29  (via drill 0.3)
  Top 0.127: v12.06,16.83 15.24,13.65 20,13.65 21.27,12.38 21.91,12.38 22.07,12.54 22.07,16.51 21.59,16.99 21.59,23.18 v24.77,26.35 | v26.19,25.4 27.3,26.51 SJ8.2
  Bottom 0.127: IC3.15 12.7,23.18 12.06,22.54 v12.06,16.83 | v24.77,26.35 26.19,26.35 v26.19,25.4
R  (via drill 0.38)
  Top 0.381: v5.56,29.84 10.79,29.84 X2.R | v3.65,31.75 0.95,29.05 0.95,9.21 8.26,1.91 10.79,1.91 X3.R
  Bottom 0.381: C3.2 10.79,1.91 X3.R | v3.65,31.75 v5.56,29.84
REL1  (via drill 0.3)
  Top 0.127: IC1.3 17.78,30.96 20.32,28.42 v21.43,28.42 | v24.77,28.42 v23.5,28.42 | v29.37,23.65 30.96,23.65 PAD3.1
  Bottom 0.127: v23.5,28.42 v21.43,28.42 | v24.77,28.42 29.37,23.81 v29.37,23.65
  Bottom 0.254: PAD3.1 R2.2
REL2  (via drill 0.3)
  Top 0.127: IC1.2 19.05,32.54 v19.68,33.18 | v24.61,34.92 26.51,34.92 27.15,35.56 v28.57,35.56
  Bottom 0.127: v19.68,33.18 24.61,33.18 v24.61,34.92 | v28.57,35.56 30.64,33.5 30.64,29.21 31.75,28.1 PAD1.1
  Bottom 0.254: R3.2 33.34,28 31.81,28 PAD1.1
S
  Bottom 0.381: X3.S 1.59,4.29 1.59,5.71 C4.2 2.38,6.67 1.11,7.94 1.11,31.75 1.43,32.07 X2.S
SINE_PWM  (via drill 0.3)
  Top 0.127: IC1.5 15.24,32.23 16.51,33.5 v16.67,33.5 | v25.56,41.59 v18.41,41.59
  Bottom 0.127: v16.67,33.5 16.67,36.83 17.78,37.94 17.78,40.96 v18.41,41.59 | v25.56,41.59 30.64,41.59 30.64,37.62 31.75,36.51 PAD14.1
  Bottom 0.406: PAD14.1 R13.1
SW1  (via drill 0.3)
  Top 0.127: IC1.6 13.97,32.23 14.92,33.18 15.72,33.18 16.83,34.29 16.83,36.35 v17.14,36.67 | v18.89,39.37 25.24,39.37 25.88,40.01 v27.78,40.01
  Bottom 0.127: v17.14,36.67 18.1,37.62 18.1,38.58 v18.89,39.37 | v27.78,40.01 30.64,37.15 30.64,34.13 PAD4.1
  Bottom 0.254: PAD4.1 31.81,33.05 34,33.05 35.34,34.38 54.67,34.38 58.39,38.1 S1.1
SW2  (via drill 0.3)
  Top 0.127: IC1.10 15.24,27.3 v15.88,27.94 | v23.18,30.32 23.18,31.11 v24.92,32.86 | v26.51,34.45 27.3,35.24 27.78,35.24 31.75,31.27 PAD5.1
  Bottom 0.127: v15.88,27.94 19.05,27.94 19.05,28.1 20.32,29.37 22.23,29.37 22.23,29.21 22.54,28.89 23.18,28.89 v23.18,30.32 | v26.51,34.45 v24.92,32.86
  Bottom 0.254: PAD5.1 34,30.48 34.29,30.19 48.2,30.19 52.01,34 61.91,34 66.01,38.1 S1.3
T  (via drill 0.38)
  Top 0.381: v7.14,34.29 1.75,28.89 1.75,18.73 3.33,17.14 5.56,17.14 9.53,13.18 9.53,10.95 X3.T
  Bottom 0.381: X2.T 9.58,36.25 7.62,34.29 v7.14,34.29 | C1.2 7.62,12.22 9.53,12.22 9.53,10.95 X3.T
VCC  (via drill 0.38)
  Top 0.381: v12.06,12.22 6.51,17.78 BUS.2 4.13,17.78 3.02,18.89 3.02,19.05 | SV3.1 11.43,37.62 3.02,29.21 3.02,19.05 | v2.86,19.05 3.02,19.05 | v22.38,10.48 23.97,8.89 25.56,8.89 | 25.56,8.89 3.3V.1 28.73,8.89 30,7.62 PAD13.1 | C10.+ 29.21,41.43 28.73,40.96 C9.1 26.51,40.96 26.04,40.96 v25.4,40.32 | SV4.3 IC1.1 | v24.13,34.45 25.72,32.86 25.72,31.91 SJ6.1 25.88,31.75 25.88,29.37 SJ7.1 25.88,29.21 25.88,26.67 SJ8.1 25.72,26.51 25.56,26.35 25.56,25.24 30.16,20.64 30.16,14.76 26.99,11.59 26.67,11.59 25.56,10.48 25.56,8.89 | v14.13,15.56 14.92,16.35 19.53,16.35 v20.8,15.08
  Bottom 0.381: R9.1 R7.1 2.22,17.94 2.22,19.05 | 2.22,19.05 R8.1 2.22,20.48 R6.1 2.22,23.02 R1.1 | v12.06,12.22 13.34,12.22 SJ10.2 13.34,12.38 14.13,13.18 v14.13,15.56 | v2.86,19.05 2.22,19.05 | 3.3V.1 28.57,8.73 25.56,8.73 24.29,7.46 24.29,5.56 23.81,5.08 SJ3.1 | 21.51,14.37 20.95,13.81 20.95,11.91 v22.38,10.48 | 21.51,14.37 22.07,14.92 22.07,18.73 22.38,19.05 SJ4.1 | v25.4,40.32 24.29,39.21 22.7,39.21 22.7,37.31 | SV4.3 22.7,37.31 | v24.13,34.45 23.97,34.61 23.97,36.2 22.86,37.31 22.7,37.31 | 21.51,14.37 v20.8,15.08
  Bottom 0.762: SI4713.7 37.15,2.86 37.15,5.05 C2.1 36.77,5.05 34.2,7.62 PAD13.1
WA0
  Bottom 0.127: SV1.1 15.24,20.16 13.97,20.16 13.34,20.8 13.34,32.7 16.67,32.7 17.14,32.23 17.14,30.16 19.84,30.16 20,30.32 20,31.11 20.32,31.43 IC3.21
WA1  (via drill 0.3)
  Top 0.127: v20.48,28.89 v21.43,29.84
  Bottom 0.127: v21.43,29.84 21.43,31.27 21.59,31.43 IC3.22 | v20.48,28.89 17.14,25.56 17.14,20.95 SV1.2
WA2  (via drill 0.3)
  Top 0.127: v22.7,29.37 22.7,28.26 21.75,27.3 v21.75,24.92 | v19.68,22.86 19.68,20.95 16.51,17.78 SV1.3
  Bottom 0.127: v22.7,29.37 22.7,31.27 22.86,31.43 IC3.23 | v19.68,22.86 v21.75,24.92
WA3  (via drill 0.3)
  Top 0.127: v20.48,23.02 20.48,20.48 SV1.4
  Bottom 0.127: v20.48,23.02 23.97,26.51 23.97,31.27 24.13,31.43 IC3.24
WA4  (via drill 0.3)
  Top 0.127: v24.29,23.02 21.91,20.64 21.91,17.14 22.38,16.67 22.38,12.38 22.07,12.06 20.32,12.06 v19.21,13.18 | v18.26,14.13 16.35,14.13 SV1.5
  Bottom 0.127: v24.29,23.02 24.29,30.32 25.4,31.43 IC3.25 | v18.26,14.13 v19.21,13.18
WA5  (via drill 0.3)
  Top 0.127: v29.53,20.16 29.53,19.53 29.69,19.37 29.69,16.99 v27.78,15.08 | v21.59,13.65 20.64,14.61 19.05,14.61 18.41,15.24 SV1.6
  Bottom 0.127: v29.53,20.16 29.84,20.48 29.84,23.81 26.83,26.83 26.83,31.27 26.67,31.43 IC3.26 | v27.78,15.08 26.35,13.65 v21.59,13.65
WA6  (via drill 0.3)
  Top 0.127: v29.84,6.83 19.84,6.83 v17.62,9.05
  Bottom 0.127: v29.84,6.83 30.48,7.46 30.48,28.89 27.94,31.43 IC3.27 | v17.62,9.05 15.24,11.43 SV1.7
WA7  (via drill 0.3)
  Top 0.127: v7.14,16.35 12.22,11.27 v16.35,11.27
  Bottom 0.127: v7.14,16.35 7.3,16.51 7.3,21.27 5.24,21.27 5.08,21.43 3.81,21.43 3.17,22.07 3.17,33.5 7.46,33.5 10.16,36.2 10.16,37.15 11.91,37.15 12.38,37.62 12.38,42.7 23.81,42.7 28.1,38.42 28.1,32.7 29.21,31.59 IC3.28 | SV1.8 v16.35,11.27
WB0  (via drill 0.3)
  Top 0.127: v29.05,20.8 27.46,20.8 26.99,21.27 25.08,21.27 SV2.1
  Bottom 0.127: v29.05,20.8 29.05,21.59 29.21,21.75 IC3.1
WB1
  Bottom 0.127: SV2.2 26.04,20.95 26.04,22.86 26.99,22.86 27.94,21.91 IC3.2
WB2
  Bottom 0.127: SV2.3 23.18,16.83 23.18,14.29 24.45,14.29 27.62,17.46 27.62,18.1 27.46,18.26 27.46,19.37 27.62,19.53 27.62,20.8 26.67,21.75 IC3.3
WB3
  Bottom 0.127: SV2.4 25.72,18.73 25.72,21.43 25.4,21.75 IC3.4
WB4
  Bottom 0.127: SV2.5 25.08,16.19 25.08,20.8 24.13,21.75 IC3.5
WB5  (via drill 0.3)
  Top 0.127: v23.02,20.32 23.02,20.16 26.67,16.51 SV2.6
  Bottom 0.127: v23.02,20.32 23.02,21.59 22.86,21.75 IC3.6
WB6  (via drill 0.3)
  Top 0.127: v26.35,23.5 v23.18,23.5 | SV2.7 v25.56,11.27
  Bottom 0.127: v23.18,23.5 21.59,21.91 IC3.7 | v26.35,23.5 28.57,23.5 28.57,20.48 29.69,19.37 29.69,11.91 26.99,9.21 25.56,9.21 v25.56,11.27
WB7  (via drill 0.3)
  Top 0.127: v22.38,20.32 22.38,18.26 26.67,13.97 SV2.8
  Bottom 0.127: v22.38,20.32 21.75,20.32 20.32,21.75 IC3.8

### Text on the board
tPlace: RELAIS NODE V1.0